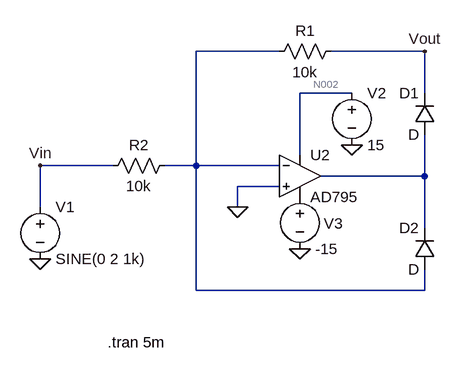
[diagram p0: schematic Alternate rectifier.asc]
Alternate rectifier.asc, the LTspice schematic file:
Version 4.1
SHEET 1 932 680
WIRE 192 -16 64 -16
WIRE 416 -16 272 -16
WIRE 304 48 224 48
WIRE 416 48 416 -16
WIRE 224 144 224 48
WIRE -64 160 -176 160
WIRE 64 160 64 -16
WIRE 64 160 16 160
WIRE 192 160 64 160
WIRE 416 176 416 112
WIRE 416 176 256 176
WIRE 192 192 128 192
WIRE -176 224 -176 160
WIRE 128 224 128 192
WIRE 416 256 416 176
WIRE 64 352 64 160
WIRE 416 352 416 320
WIRE 416 352 64 352
FLAG 128 224 0
FLAG -176 304 0
FLAG 304 128 0
FLAG 224 288 0
FLAG -176 160 Vin
FLAG 416 -16 Vout
SYMBOL diode 432 112 R180
WINDOW 0 24 64 Left 2
WINDOW 3 24 0 Left 2
SYMATTR InstName D1
SYMBOL diode 432 320 R180
WINDOW 0 24 64 Left 2
WINDOW 3 24 0 Left 2
SYMATTR InstName D2
SYMBOL res 288 -32 R90
WINDOW 0 0 56 VBottom 2
WINDOW 3 32 56 VTop 2
SYMATTR InstName R1
SYMATTR Value 10k
SYMBOL res 32 144 R90
WINDOW 0 0 56 VBottom 2
WINDOW 3 32 56 VTop 2
SYMATTR InstName R2
SYMATTR Value 10k
SYMBOL voltage -176 208 R0
WINDOW 123 0 0 Left 0
WINDOW 39 0 0 Left 0
SYMATTR InstName V1
SYMATTR Value SINE(0 2 1k)
SYMBOL voltage 304 32 R0
WINDOW 123 0 0 Left 0
WINDOW 39 0 0 Left 0
SYMATTR InstName V2
SYMATTR Value 15
SYMBOL voltage 224 192 R0
WINDOW 0 37 57 Left 2
WINDOW 123 0 0 Left 0
WINDOW 39 0 0 Left 0
SYMATTR InstName V3
SYMATTR Value -15
SYMBOL OpAmps\\AD795 224 112 R0
SYMATTR InstName U2
TEXT -72 432 Left 2 !.tran 5m

The netlist it stands for:
* Alternate rectifier.asc
D1 N003 Vout D
D2 N001 N003 D
R1 Vout N001 10k
R2 N001 Vin 10k
V1 Vin 0 SINE(0 2 1k)
V2 N002 0 15
V3 P001 0 -15
X§U2 0 N001 N002 P001 N003 AD795  ; pins In+ In- V+ V- OUT
.model D D
.lib standard.dio
.tran 5m
.lib ADI1.lib
.backanno
.end

* Results of the author's LTspice run, read from the files saved beside the schematic
* Operating Point, zero values left out:
*   V(n002) = 15 V
*   V(p001) = -15 V
*   I(V2) = -1.226 mA
*   I(V3) = 1.226 mA
*   Ix(u2:3) = 1.226 mA
*   Ix(u2:4) = -1.226 mA
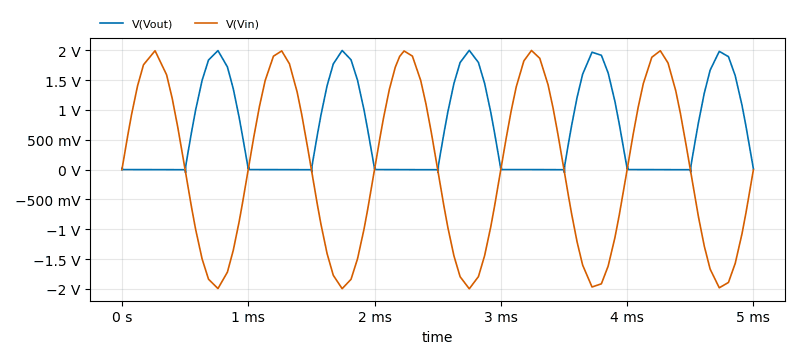
[diagram p1: Transient Analysis of Alternate rectifier.asc, plotted from the saved traces]
* Transient Analysis, 1 run:
*   V(Vout): min -48.79 mV, max 2 V, average 629.1 mV, rms 991.8 mV, last 10.95 mV
*   V(Vin): min -2 V, max 1.998 V, average -68.64 µV, rms 1.403 V, last 0 V